# EAGLE design IZU2023_board2_ver7 (2) (EAGLE 9.6.2)
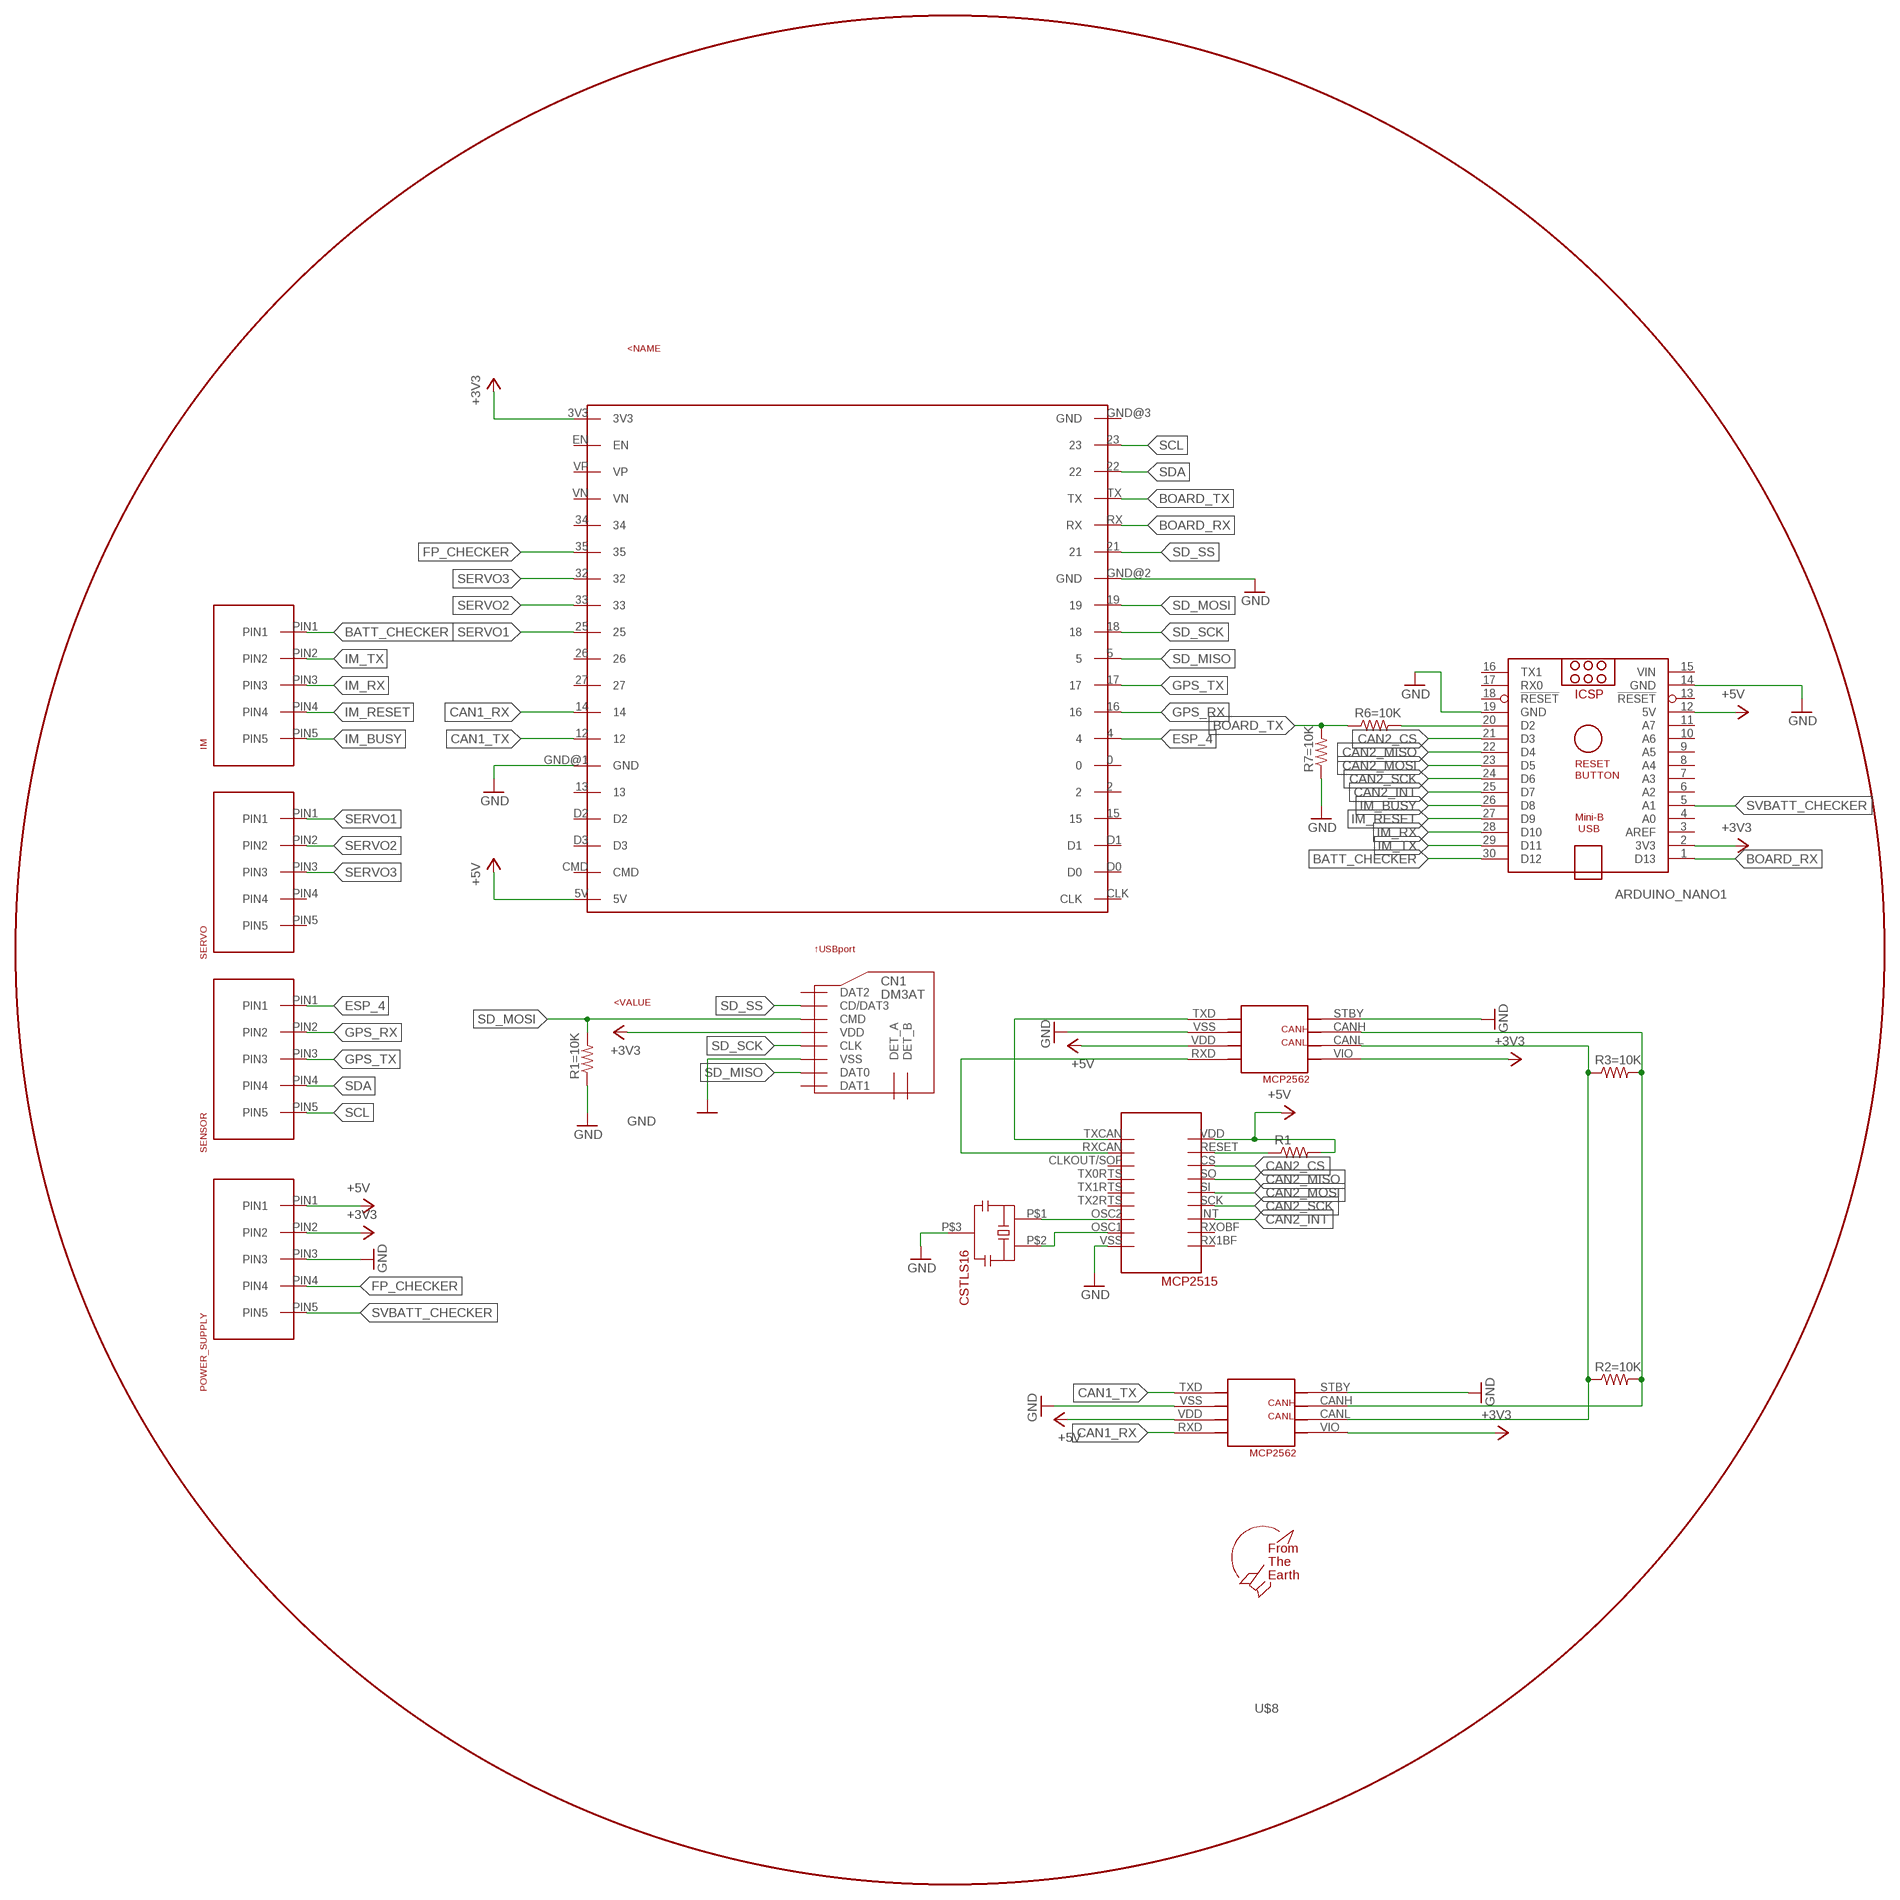
[diagram p0: schematic, sheet 1]

## Parts
ARDUINO_NANO1  ARDUINO_NANO  [ARDUINO_NANO]
CN1  DM3AT  [DM3AT]
IM  5PIN  [5PIN]
POWER_SUPPLY  5PIN  [5PIN]
R1  R-US_0204/7  [0204/7]
R1=10K  R-US_0204/7  [0204/7]
R2=10K  R-US_0204/7  [0204/7]
R3=10K  R-US_0204/7  [0204/7]
R6=10K  R-US_0204/7  [0204/7]
R7=10K  R-US_0204/7  [0204/7]
SENSOR  5PIN  [5PIN]
SERVO  5PIN  [5PIN]
U$1  ESP32-DEVKITC  [ESP32-DEVKITC]
U$2  MCP2515  [MCP2515]
U$3  MCP2562  [MCP2562]
U$4  MCP2562  [MCP2562]
U$5  CSTLS16  [CSTLS16]
U$8  F.T.E.LOGO  [LOGO]

## Nets
+3V3 [Power]: ARDUINO_NANO1.2(3V3) CN1.VDD POWER_SUPPLY.PIN2 U$1.3V3 U$3.VIO U$4.VIO
+5V [Power]: ARDUINO_NANO1.12(5V) POWER_SUPPLY.PIN1 R1.2 U$1.5V U$2.VDD U$3.VDD U$4.VDD
BATT_CHECKER: ARDUINO_NANO1.30(D12) IM.PIN1
BOARD_RX: ARDUINO_NANO1.1(D13) U$1.RX
BOARD_TX: R6=10K.1 R7=10K.2 U$1.TX
CAN1_RX: U$1.14 U$3.RXD
CAN1_TX: U$1.12 U$3.TXD
CAN2_CS: ARDUINO_NANO1.21(D3) U$2.CS
CAN2_INT: ARDUINO_NANO1.25(D7) U$2.INT
CAN2_MISO: ARDUINO_NANO1.22(D4) U$2.SO
CAN2_MOSI: ARDUINO_NANO1.23(D5) U$2.SI
CAN2_SCK: ARDUINO_NANO1.24(D6) U$2.SCK
ESP_4: SENSOR.PIN1 U$1.4
FP_CHECKER: POWER_SUPPLY.PIN4 U$1.35
GND: ARDUINO_NANO1.14(GND) ARDUINO_NANO1.19(GND) CN1.VSS POWER_SUPPLY.PIN3 R1=10K.1 R7=10K.1 U$1.GND@1(GND) U$1.GND@2(GND) U$2.VSS U$3.STBY U$3.VSS U$4.STBY U$4.VSS U$5.P$3
GPS_RX: SENSOR.PIN2 U$1.16
GPS_TX: SENSOR.PIN3 U$1.17
IM_BUSY: ARDUINO_NANO1.26(D8) IM.PIN5
IM_RESET: ARDUINO_NANO1.27(D9) IM.PIN4
IM_RX: ARDUINO_NANO1.28(D10) IM.PIN3
IM_TX: ARDUINO_NANO1.29(D11) IM.PIN2
N$1: U$2.TXCAN U$4.TXD
N$2: ARDUINO_NANO1.20(D2) R6=10K.2
N$3: R2=10K.1 R3=10K.1 U$3.CANL U$4.CANL
N$4: R2=10K.2 R3=10K.2 U$3.CANH U$4.CANH
N$5: U$2.RXCAN U$4.RXD
N$6: U$2.OSC2 U$5.P$1
N$7: U$2.OSC1 U$5.P$2
N$8: R1.1 U$2.RESET
SCL: SENSOR.PIN5 U$1.23
SD_MISO: CN1.DAT0 U$1.5
SD_MOSI: CN1.CMD R1=10K.2 U$1.19
SD_SCK: CN1.CLK U$1.18
SD_SS: CN1.CD/DAT3 U$1.21
SDA: SENSOR.PIN4 U$1.22
SERVO1: SERVO.PIN1 U$1.25
SERVO2: SERVO.PIN2 U$1.33
SERVO3: SERVO.PIN3 U$1.32
SVBATT_CHECKER: ARDUINO_NANO1.5(A1) POWER_SUPPLY.PIN5
Unconnected: ARDUINO_NANO1.3(AREF) ARDUINO_NANO1.4(A0) ARDUINO_NANO1.6(A2) ARDUINO_NANO1.7(A3) ARDUINO_NANO1.8(A4) ARDUINO_NANO1.9(A5) ARDUINO_NANO1.10(A6) ARDUINO_NANO1.11(A7) ARDUINO_NANO1.13(!RESET) ARDUINO_NANO1.16(TX1) ARDUINO_NANO1.17(RX0) ARDUINO_NANO1.18(!RESET) CN1.DAT1 CN1.DAT2 CN1.DET_A CN1.DET_B SERVO.PIN4 SERVO.PIN5 U$1.0 U$1.2 U$1.13 U$1.15 U$1.26 U$1.27 U$1.34 U$1.CLK U$1.CMD U$1.D0 U$1.D1 U$1.D2 U$1.D3 U$1.EN U$1.GND@3(GND) U$1.VN U$1.VP U$2.CLKOUT/SOF U$2.RX1BF U$2.RXOBF(RX0BF) U$2.TX0RTS U$2.TX1RTS U$2.TX2RTS

## Power pins joined to a net without a drawn wire
VIN: ARDUINO_NANO1.15(VIN)

## Library data of the parts
ARDUINO_NANO1 = ArduinoNanoV30:ARDUINO_NANO: Arduino Nano V3.0 Overview: The Arduino Nano is a small, complete, and breadboard-friendly board based on the ATmega328 (Arduino Nano 3.x) or ATmega168 (Arduino Nano 2.x). It has more or less the same functionality of the Arduino Duemilanove, but in a different package. It lacks only a DC power jack, and works with a Mini-B USB cable instead of a standard one. The Nano was designed and is being produced by Gravitech. Specifications: Microcontroller Atmel ATmega168 or ATmega328 Operating Voltage (logic level) 5 V Input Voltage (recommended) 7-12 V Input Voltage (limits) 6-20 V Digital I/O Pins 14 (of which 6 provide PWM output) Analog Input Pins 8 DC Current per I/O Pin 40 mA Flash Memory 16 KB (ATmega168) or 32 KB (ATmega328) of which 2 KB used by bootloader SRAM 1 KB (ATmega168) or 2 KB (ATmega328) EEPROM 512 bytes (ATmega168) or 1 KB (ATmega328) Clock Speed 16 MHz Dimensions 0.73" x 1.70" Length 45 mm Width 18 mm Weigth 5 g Power: The Arduino Nano can be powered via the Mini-B USB connection, 6-20V unregulated external power supply (pin 30), or 5V regulated external power supply (pin 27). The power source is automatically selected to the highest voltage source. Memory: The ATmega168 has 16 KB of flash memory for storing code (of which 2 KB is used for the bootloader); the ATmega328 has 32 KB, (also with 2 KB used for the bootloader). The ATmega168 has 1 KB of SRAM and 512 bytes of EEPROM (which can be read and written with the EEPROM library); the ATmega328 has 2 KB of SRAM and 1 KB of EEPROM. Input and Output: Each of the 14 digital pins on the Nano can be used as an input or output, using pinMode(), digitalWrite(), and digitalRead() functions. They operate at 5 volts. Each pin can provide or receive a maximum of 40 mA and has an internal pull-up resistor (disconnected by default) of 20-50 kOhms. In addition, some pins have specialized functions. Visit Arduino - ArduinoBoardNano <https://www.arduino.cc/en/Main/ArduinoBoardNano>
CN1 = microSD:DM3AT
IM POWER_SUPPLY SENSOR SERVO = connectors:5PIN
R1 R1=10K R2=10K R3=10K R6=10K R7=10K = rcl:R-US_: RESISTOR, American symbol; SPICEPREFIX: R
U$1 = ESP32-DevKitC:ESP32-DEVKITC
U$2 = MCP2515:MCP2515
U$3 U$4 = MCP2562:MCP2562
U$5 = CSTLS16:CSTLS16
U$8 = logo:F.T.E.LOGO

## Net classes
1 Power: width 1.016 mm

## Board
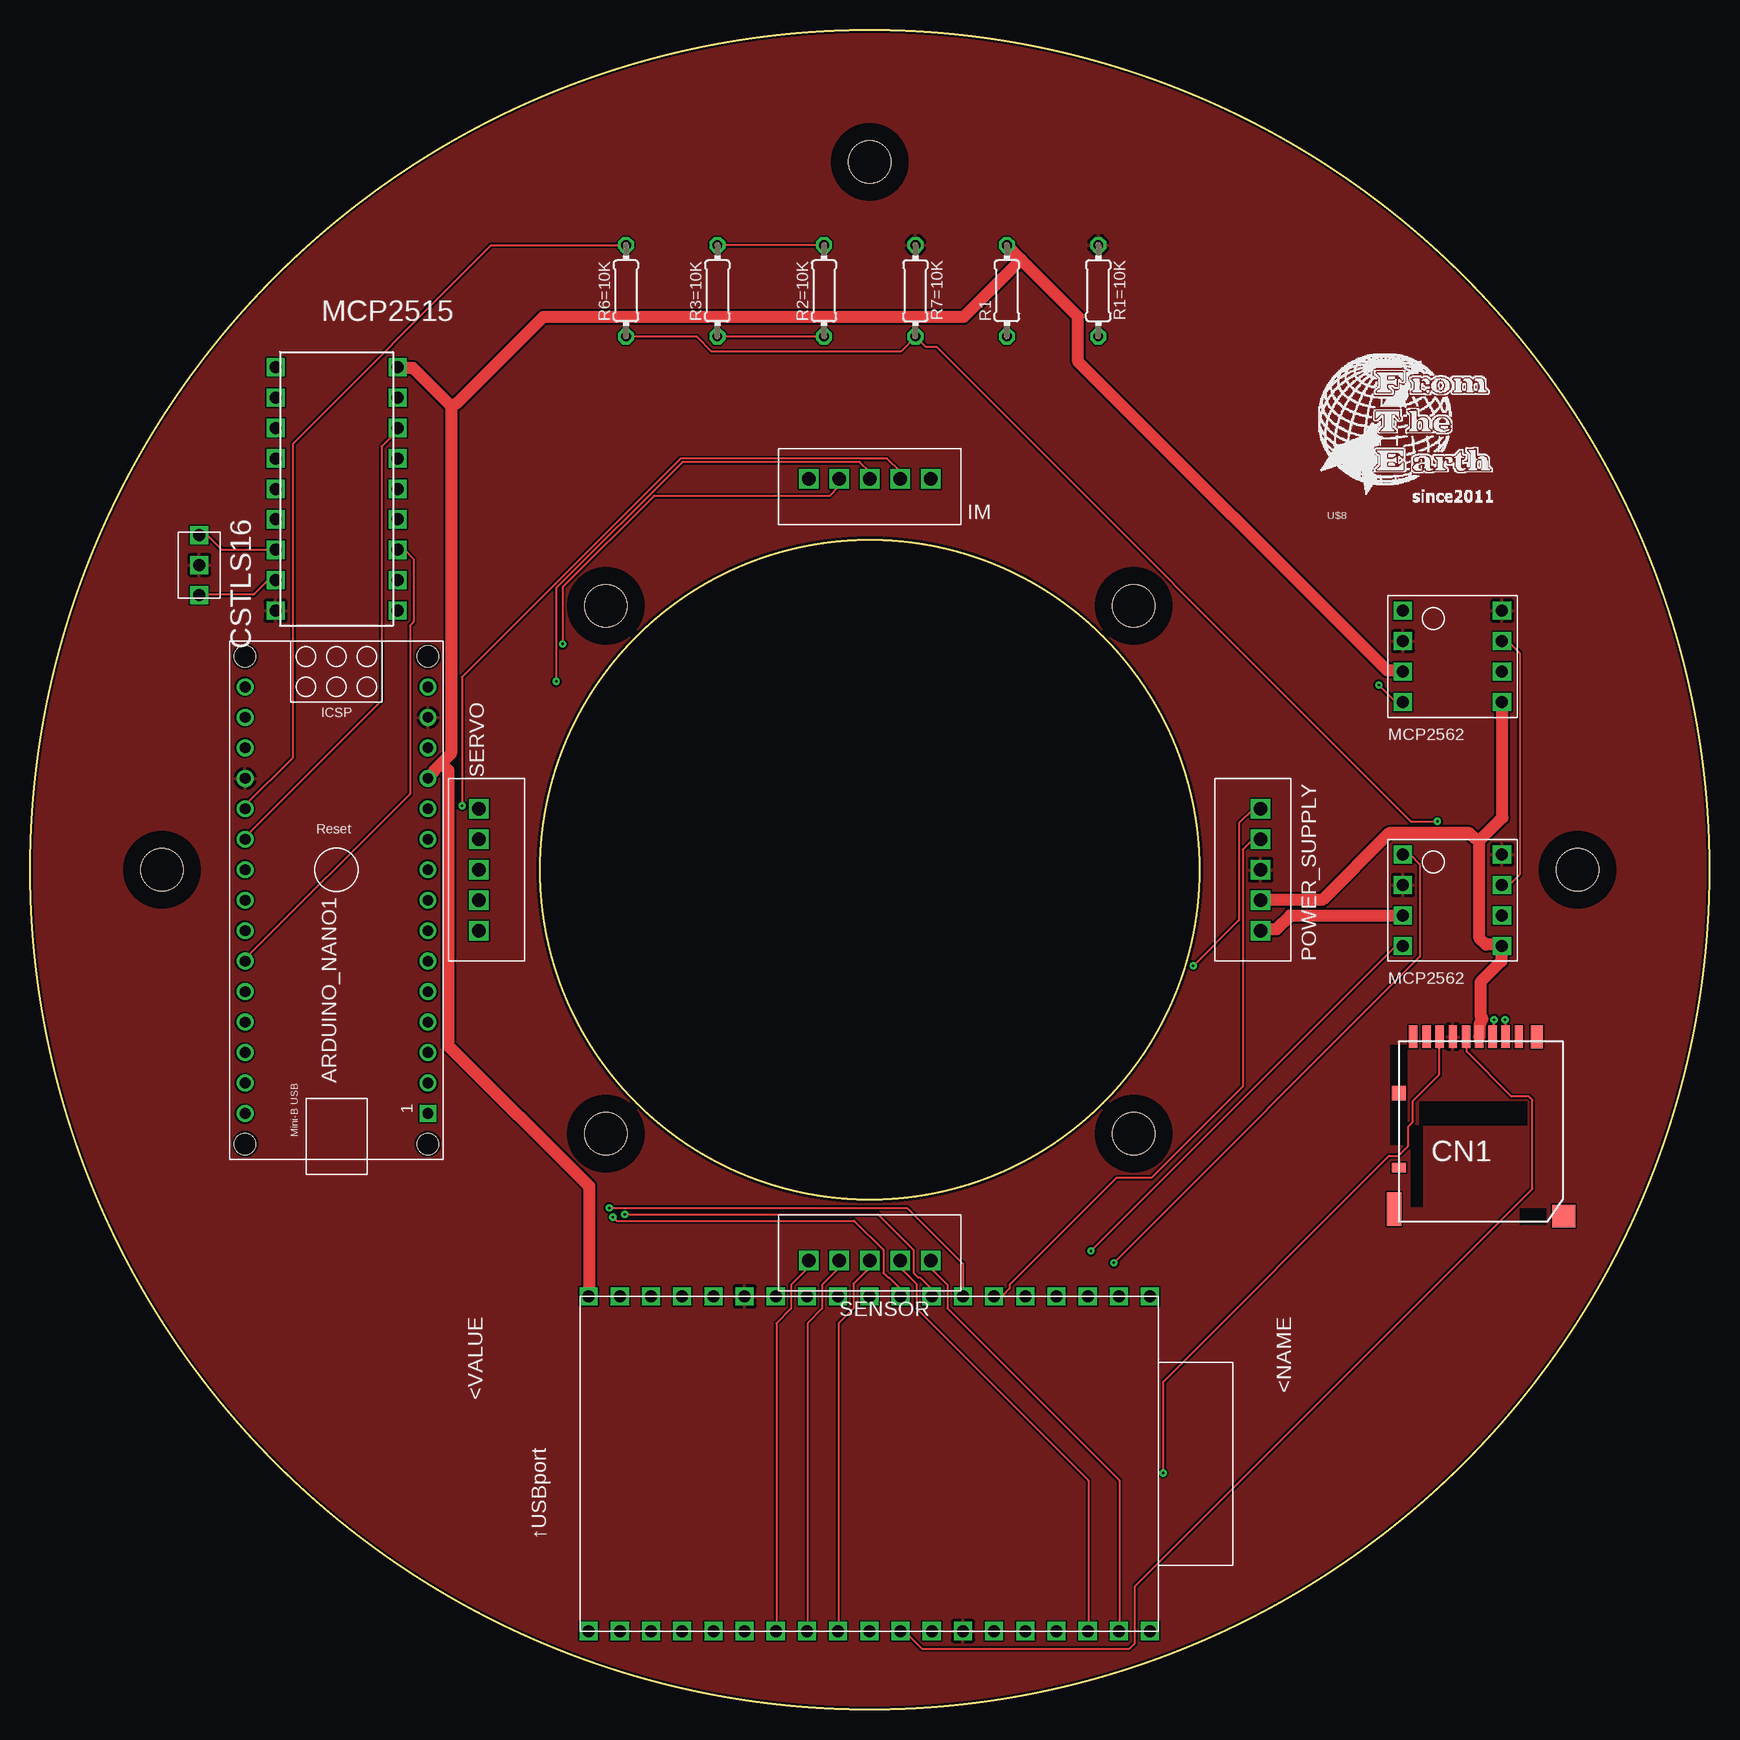
[diagram p1: board, top side]
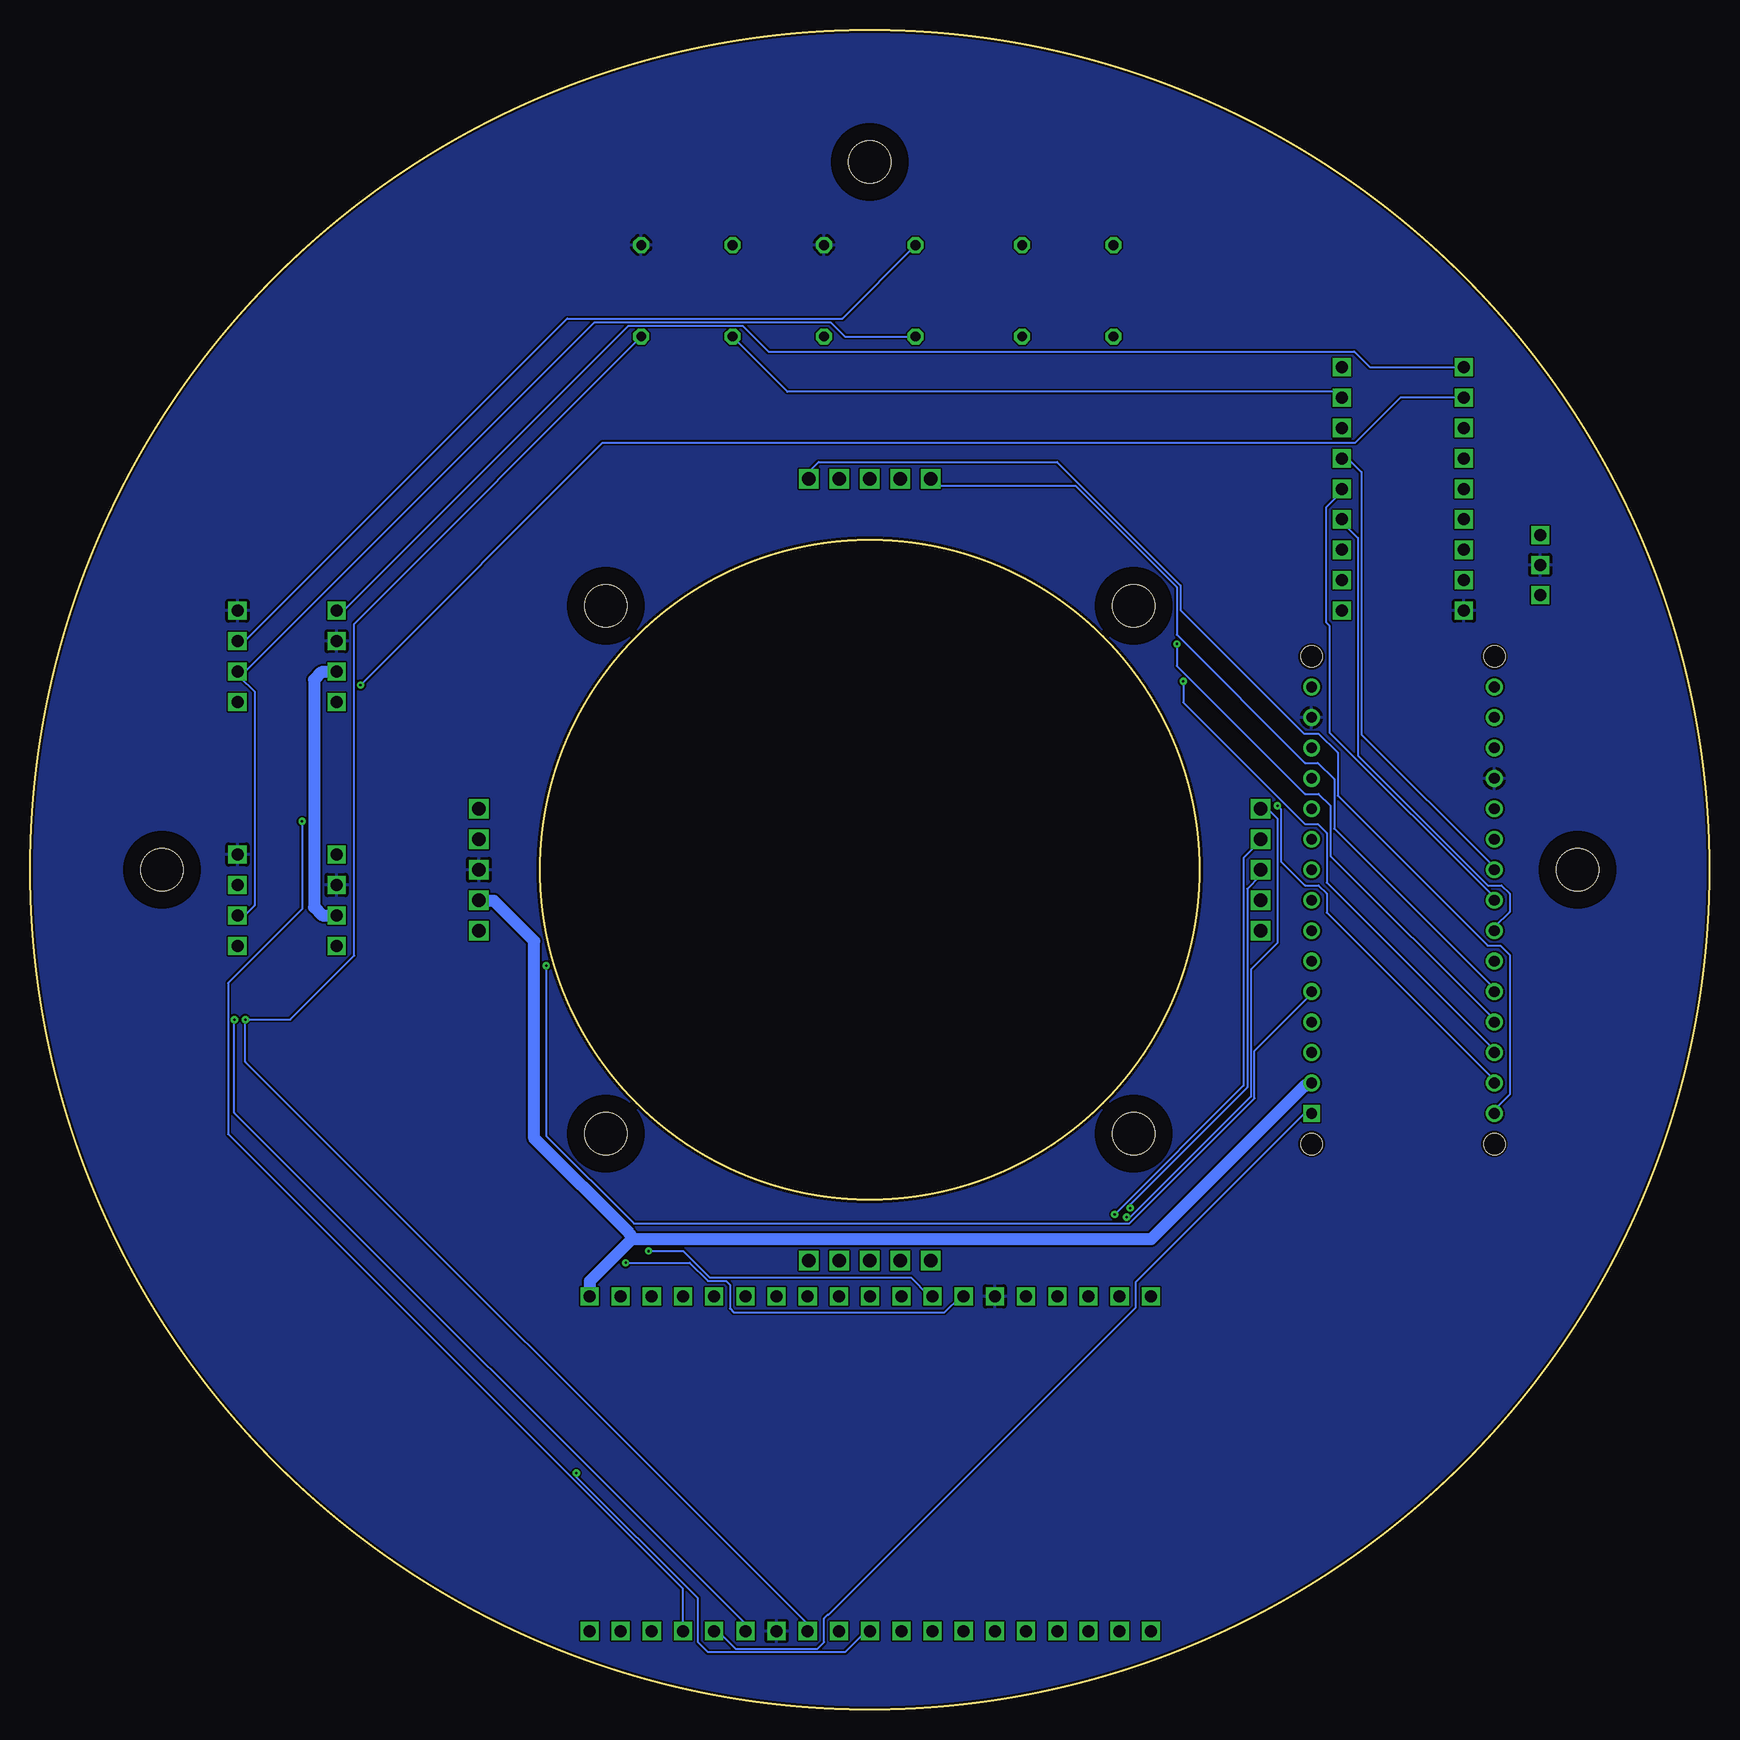
[diagram p2: board, bottom side, seen from below]

Size 140 x 140 mm. Coordinates in mm from the lower left corner, seen from the top.
Outline: circle at 70,70 radius 70
Outline: circle at 70,70 radius 27.5
Copper layers (1*16): Top 0.035mm / dielectric 1.5mm / Bottom 0.035mm
Design rules "PCBGoGo": minimum track width 6mil, minimum drill 0.2mm, track to track 6mil, track to pad 6mil, pad to pad 6mil, via to via 6mil, smd to smd 6mil, copper to edge 0.2mm, drill to drill 6mil, minimum pad ring 10mil, minimum via ring 8mil, stop-mask expansion 4mil, vias tented up to drill 0mil, thermal gap 10mil
Holes 3.5 mm at 70,129 129,70 11,70 92,92 48,48 48,92 92,48
tRestrict: area 44.9,88.8 to 51.1,95.2; area 44.9,44.9 to 51.1,51.1; area 88.8,44.9 to 95.2,51.1; area 88.8,88.8 to 95.2,95.2; area 125.8,66.8 to 132.2,73.2; area 66.8,125.8 to 73.2,132.2; area 7.9,66.8 to 14.1,73.2
bRestrict: area 7.9,66.8 to 14.1,73.2; area 88.8,44.9 to 95.2,51.1; area 125.8,66.8 to 132.2,73.2; area 88.8,88.8 to 95.2,95.2; area 44.9,44.9 to 51.1,51.1; area 44.9,88.8 to 51.1,95.2; area 66.8,125.8 to 73.2,132.2
vRestrict: area 114.5,40.8 to 128.4,56; area 45.9,6.5 to 94.1,34.4; area 16.7,45.9 to 34.4,89; area 11.6,91.6 to 16.7,99.2; area 20.5,90.3 to 30.6,113.2; area 113.2,82.7 to 123.3,92.9; area 113.2,62.4 to 124.6,72.5; area 123.3,82.7 to 124.6,92.9

### Footprints (pad centres in the part's own frame; a part is rotated, then mirrored left to right if it is on the bottom)
ARDUINO_NANO = drill 0.9 square: 1 -20.32,-7.62 | drill 0.9: 2 -17.78,-7.62; 3 -15.24,-7.62; 4 -12.7,-7.62; 5 -10.16,-7.62; 6 -7.62,-7.62; 7 -5.08,-7.62; 8 -2.54,-7.62; 9 0,-7.62; 10 2.54,-7.62; 11 5.08,-7.62; 12 7.62,-7.62; 13 10.16,-7.62; 14 12.7,-7.62; 15 15.24,-7.62; 16 15.24,7.62; 17 12.7,7.62; 18 10.16,7.62; 19 7.62,7.62; 20 5.08,7.62; 21 2.54,7.62; 22 0,7.62; 23 -2.54,7.62; 24 -5.08,7.62; 25 -7.62,7.62; 26 -10.16,7.62; 27 -12.7,7.62; 28 -15.24,7.62; 29 -17.78,7.62; 30 -20.32,7.62 | hole 1.778: -22.86,-7.62; -22.86,7.62; 17.78,7.62; 17.78,-7.62
DM3AT = smd 0.7 x 1.9: CD/DAT3 2.2,6.4; CLK -1.1,6.4; CMD 1.1,6.4; DAT0 -3.3,6.4; DAT1 -4.4,6.4; DAT2 3.3,6.4; DET_B -5.5,6.4; VDD 0,6.4; VSS -2.2,6.4 | smd 1.2 x 0.8: DET_A -6.7,-4.5 | smd 1 x 1.9: P$9 4.8,6.381 | smd 1.2 x 1.2: P$11 -6.7,1.7 | smd 1.2 x 2.8: P$13 -7.081,-7.973 | smd 1.9 x 1.9: P$14 7.054,-8.562
5PIN = drill 1.1 square: PIN1 -5.08,-5.08; PIN2 -2.54,-5.08; PIN3 0,-5.08; PIN4 2.54,-5.08; PIN5 5.08,-5.08
0204/7 = drill 0.813 octagon: 1 -3.81,0; 2 3.81,0
ESP32-DEVKITC = drill 1 square: 0 27.9,13.7; 2 27.9,11.1; 3V3 0,47.5; 4 27.9,16.3; 5 27.9,24.1; 5V 0,0.7; 12 0,16.3; 13 0,11.1; 14 0,18.9; 15 27.9,8.5; 16 27.9,18.9; 17 27.9,21.5; 18 27.9,26.7; 19 27.9,29.3; 21 27.9,34.5; 22 27.9,42.3; 23 27.9,44.9; 25 0,26.7; 26 0,24.1; 27 0,21.5; 32 0,31.9; 33 0,29.3; 34 0,37.1; 35 0,34.5; CLK 27.9,0.7; CMD 0,3.3; D0 27.9,3.3; D1 27.9,5.9; D2 0,8.5; D3 0,5.9; EN 0,44.9; GND@1 0,13.7; GND@2 27.9,31.9; GND@3 27.9,47.5; RX 27.9,37.1; TX 27.9,39.7; VN 0,39.7; VP 0,42.3
MCP2515 = drill 1 square: CLKOUT/SOF -5.08,5.08; CS 5.08,5.08; INT 5.08,-5.08; OSC1 -5.08,-7.62; OSC2 -5.08,-5.08; RESET 5.08,7.62; RX1BF 5.08,-10.16; RXCAN -5.08,7.62; RXOBF 5.08,-7.62; SCK 5.08,-2.54; SI 5.08,0; SO 5.08,2.54; TX0RTS -5.08,2.54; TX1RTS -5.08,0; TX2RTS -5.08,-2.54; TXCAN -5.08,10.16; VDD 5.08,10.16; VSS -5.08,-10.16
MCP2562 = drill 1 square: CANH 8.255,6.35; CANL 8.255,3.81; RXD 0,1.27; STBY 8.255,8.89; TXD 0,8.89; VDD 0,3.81; VIO 8.255,1.27; VSS 0,6.35
CSTLS16 = drill 1 square: P$1 -2.5,0; P$2 2.5,0; P$3 0,0

### Placement (x,y rotation side)
ARDUINO_NANO1  25.55,70 90 top
CN1  120.8,49.68 0 top
IM  70,97.5 180 top
POWER_SUPPLY  97.5,70 90 top
R1  81.43,118.26 90 top
R1=10K  89.05,118.26 270 top
R2=10K  66.19,118.26 90 top
R3=10K  57.3,118.26 90 top
R6=10K  49.68,118.26 90 top
R7=10K  73.81,118.26 270 top
SENSOR  70,42.5 0 top
SERVO  42.5,70 270 top
U$1  45.87,34.44 270 top
U$2  25.55,101.75 0 top
U$3  114.45,62.38 0 top
U$4  114.45,82.7 0 top
U$5  14.12,95.4 270 top
U$8  106.83,99.21 0 top

### Tracks (layer width: path | path; a pad name or v marks a point on that pad's centre or on a via)
+3V3
  Top 1.016: CN1.VDD 120.83,56.13 120.83,57.12 120.9,57.2 120.9,57.35 121.05,57.5 121.05,57.66 120.9,57.81 120.9,60.63 122.65,62.38 122.65,63.6 U$3.VIO 122.2,63.75 121.36,63.75 120.83,64.28 120.83,72.44 | 120.83,72.44 122.73,74.34 122.73,83.94 U$4.VIO | POWER_SUPPLY.PIN2 102.61,67.48 107.72,67.48 113.28,73.05 119.99,73.05 120.37,72.67 120.83,72.44
  Bottom 1.016: 89.81,39.22 46.53,39.22 33.8,51.94 33.73,51.94 33.5,52.17 33.2,52.17 ARDUINO_NANO1.2 | 89.81,39.22 93.32,35.71 93.32,34.49 U$1.3V3 | POWER_SUPPLY.PIN2 102.54,67.41 101.32,67.41 97.97,64.06 97.97,47.6 90.04,39.67 89.81,39.22
+5V
  Top 1.016: U$3.VDD 105.05,66.19 103.91,65.05 102.69,65.05 102.61,64.97 POWER_SUPPLY.PIN1 | 82.61,120.86 87.37,116.1 87.37,112.37 113.13,86.61 114.35,86.61 U$4.VDD | 82.61,120.86 81.43,122.05 R1.2 | 34.3,78.88 35.1,79.68 35.1,108.63 | 34.3,78.88 33.73,78.31 33.73,78.23 33.2,77.7 33.2,77.62 ARDUINO_NANO1.12 | 35.1,108.63 31.9,111.83 30.76,111.83 30.68,111.91 U$2.VDD | U$1.5V 46.61,34.49 46.61,43.64 34.87,55.37 34.87,78.31 34.3,78.88 | 82.61,120.86 77.85,116.1 42.8,116.1 35.56,108.86 35.1,108.63
  Bottom 1.016: U$3.VDD 115.64,66.19 116.33,66.88 116.33,85.85 115.72,86.46 114.5,86.46 U$4.VDD
BATT_CHECKER
  Bottom 0.152: ARDUINO_NANO1.30 17.88,49.73 17.88,50.04 16.66,51.25 16.66,62.91 17.42,63.67 18.49,63.67 30.99,76.17 30.99,79.75 32.59,81.35 33.8,81.35 44.09,91.64 44.09,93.7 54.38,103.98 74.27,103.98 75.03,103.22 75.03,102.61 IM.PIN1
BOARD_RX
  Bottom 0.152: ARDUINO_NANO1.1 33.2,49.66 33.8,49.66 47.83,35.63 47.83,33.5 73.43,7.9 73.5,7.9 73.81,7.59 73.81,5.61 74.34,5.08 81.2,5.08 82.65,6.52 82.95,6.52 U$1.RX
BOARD_TX  (via drill 0.2)
  Top 0.152: 73.81,114.42 72.59,113.2 56.82,113.2 55.6,114.42 49.73,114.42 R6=10K.1 | v117.32,74.04 115.11,74.04 75.56,113.59 74.65,113.59 73.81,114.42 | 73.81,114.42 R7=10K.2
  Bottom 0.152: v117.32,74.04 117.32,66.72 123.49,60.55 123.49,47.98 85.62,10.11 85.62,6.6 U$1.TX
CAN1_RX  (via drill 0.2)
  Top 0.152: v88.44,38.23 113.81,63.6 114.42,63.6 U$3.RXD
  Bottom 0.152: v88.44,38.23 85.55,38.23 83.34,36.02 66.57,36.02 65.05,34.49 64.82,34.49 U$1.14
CAN1_TX  (via drill 0.2)
  Top 0.152: v90.34,37.23 115.87,62.76 115.87,70.46 115.11,71.22 114.5,71.22 U$3.TXD
  Bottom 0.152: v90.34,37.23 85.01,37.23 83.49,35.71 81.96,35.71 81.66,35.41 81.66,33.42 81.35,33.12 63.75,33.12 62.46,34.41 62.23,34.41 U$1.12
CAN2_CS
  Top 0.152: ARDUINO_NANO1.21 17.95,72.59 17.95,72.74 29.31,84.1 29.31,105.28 30.6,106.58 30.6,106.81 U$2.CS
CAN2_INT
  Top 0.152: U$2.INT 31.21,96.67 31.98,95.91 31.98,90.65 31.67,90.34 31.67,76.33 17.95,62.61 17.95,62.38 ARDUINO_NANO1.25
CAN2_MISO
  Bottom 0.152: U$2.SO 30.15,104.29 29,103.15 29,81.28 17.95,70.23 17.95,70 ARDUINO_NANO1.22
CAN2_MOSI
  Bottom 0.152: ARDUINO_NANO1.23 17.95,67.48 17.95,67.71 31.67,81.43 31.67,90.34 31.98,90.65 31.98,100.17 30.68,101.47 30.68,101.7 U$2.SI
CAN2_SCK
  Bottom 0.152: ARDUINO_NANO1.24 17.88,64.97 17.88,65.28 16.66,66.5 16.66,68.02 17.35,68.7 18.49,68.7 29.31,79.53 29.31,97.66 30.6,98.96 30.6,99.19 U$2.SCK
ESP_4
  Top 0.152: U$1.4 62.23,6.6 62.23,32.2 63.45,33.42 63.45,35.41 64.89,36.85 64.89,37.39 SENSOR.PIN1
FP_CHECKER
  Top 0.152: U$1.35 80.44,34.49 81.05,34.49 81.66,35.1 81.66,35.41 90.57,44.32 93.47,44.32 101.09,51.94 101.09,71.68 101.93,72.52 102.54,72.52 POWER_SUPPLY.PIN4
GND
  pour Bottom: 30.63,141.12 103.02,141.12 106.83,137.31 142.39,101.75 142.39,35.71 105.56,-1.12 33.17,-1.12 -4.93,36.98 -4.93,115.72 20.47,141.12
  pour Top: 19.2,144.93 104.29,144.93 147.47,101.75 147.47,31.9 146.2,30.63 110.64,-4.93 109.37,-4.93 26.82,-4.93 -15.09,36.98 -15.09,119.53 -11.28,123.34 10.31,144.93
GPS_RX
  Top 0.152: U$1.16 64.82,6.6 64.82,32.2 66.04,33.42 66.04,35.41 67.41,36.78 67.41,37.39 SENSOR.PIN2
GPS_TX
  Top 0.152: SENSOR.PIN3 70,36.85 68.63,35.48 68.63,33.42 67.41,32.2 67.41,6.6 U$1.17
IM_BUSY
  Bottom 0.152: ARDUINO_NANO1.26 17.95,59.87 17.95,60.09 31.29,73.43 31.29,77.54 32.66,78.91 33.73,78.91 44.4,89.58 44.4,93.55 52.86,102 64.36,102 64.89,102.54 IM.PIN5
IM_RESET  (via drill 0.2)
  Top 0.152: v44.4,88.82 44.4,93.55 52.02,101.17 66.65,101.17 67.41,101.93 67.41,102.54 IM.PIN4
  Bottom 0.152: v44.4,88.82 44.4,86.99 33.73,76.33 32.59,76.33 31.59,75.33 31.59,71.14 17.95,57.5 17.95,57.35 ARDUINO_NANO1.27
IM_RX  (via drill 0.2)
  Top 0.152: v43.86,85.7 43.86,93.47 54.38,103.98 69.16,103.98 70,103.15 IM.PIN3
  Bottom 0.152: v43.86,85.7 43.86,83.94 33.73,73.81 32.66,73.81 31.9,73.05 31.9,68.93 17.95,54.99 17.95,54.76 ARDUINO_NANO1.28
IM_TX  (via drill 0.2)
  Top 0.152: v36.02,75.33 36.02,86.08 54.23,104.29 71.45,104.29 72.52,103.22 72.52,102.61 IM.PIN2
  Bottom 0.152: v36.02,75.33 35.71,75.03 35.71,70.69 33.73,68.7 32.59,68.7 31.9,68.02 31.9,66.42 17.95,52.47 17.95,52.25 ARDUINO_NANO1.29
N$1
  Bottom 0.152: U$2.TXCAN 28.32,111.91 29.61,113.2 78.46,113.2 80.59,115.34 90.12,115.34 113.81,91.64 114.42,91.64 U$4.TXD
N$2
  Top 0.152: R6=10K.2 49.66,122.05 38.45,122.05 21.92,105.51 21.92,79.37 17.95,75.41 17.95,75.11 ARDUINO_NANO1.20
N$3
  Top 0.152: R3=10K.1 57.35,114.42 66.19,114.42 R2=10K.1
  Bottom 0.152: U$3.CANL 122.12,66.19 121.28,67.03 121.28,84.86 122.5,86.08 | 122.5,86.08 122.65,86.23 122.65,86.46 U$4.CANL 122.5,86.08 | 122.5,86.08 92.94,115.64 73.28,115.64 72.06,114.42 66.19,114.42 R2=10K.1
N$4
  Top 0.152: R3=10K.2 57.35,122.05 66.19,122.05 R2=10K.2 | U$4.CANH 123.19,89.05 124.18,88.06 124.18,69.62 123.34,68.78 122.73,68.78 U$3.CANH
  Bottom 0.152: U$4.CANH 122.12,89.05 95.22,115.95 72.29,115.95 66.19,122.05 R2=10K.2
N$5  (via drill 0.2)
  Top 0.152: v112.44,85.39 113.81,84.02 114.42,84.02 U$4.RXD
  Bottom 0.152: v112.44,85.39 92.25,105.59 29.54,105.59 25.73,109.4 20.47,109.4 U$2.RXCAN
N$6
  Top 0.152: U$2.OSC2 15.97,96.67 14.76,97.89 14.15,97.89 U$5.P$1
N$7
  Top 0.152: U$5.P$2 14.15,92.94 18.64,92.94 19.78,94.08 20.47,94.08 U$2.OSC1
N$8
  Bottom 0.152: R1.1 81.43,114.42 76.86,109.85 31.14,109.85 30.68,109.4 U$2.RESET
SCL
  Top 0.152: U$1.23 90.8,6.6 90.8,19.1 76.48,33.42 76.48,35.41 75.11,36.78 75.11,37.39 SENSOR.PIN5
SD_MISO  (via drill 0.2)
  Top 0.152: v94.46,19.71 94.46,27.33 113.28,46.15 114.04,46.15 114.88,46.99 114.88,48.59 115.26,48.97 115.26,50.72 117.47,52.93 117.47,56.05 CN1.DAT0
  Bottom 0.152: v94.46,19.71 94.46,19.4 84.33,9.27 84.33,5.61 83.49,4.77 72.06,4.77 70.31,6.52 70,6.52 U$1.5
SD_MOSI  (via drill 0.2)
  Top 0.152: v122.05,57.5 121.97,57.43 121.97,56.13 CN1.CMD
  Bottom 0.152: U$1.19 75.18,6.6 75.18,7.13 122.05,54 v122.05,57.5 118.31,57.5 112.98,62.84 112.98,90.5 89.05,114.42 R1=10K.2
SD_SCK
  Top 0.152: CN1.CLK 119.76,56.05 119.76,54.84 123.49,51.1 124.94,51.1 125.25,50.8 125.25,43.41 92.1,10.26 92.1,5.53 91.64,5.08 74.34,5.08 72.9,6.52 72.59,6.52 U$1.18
SD_SS  (via drill 0.2)
  Top 0.152: v122.96,57.5 122.96,56.13 CN1.CD/DAT3
  Bottom 0.152: v122.96,57.5 122.96,49.73 80.44,7.21 80.44,6.6 U$1.21
SDA
  Top 0.152: U$1.22 88.21,6.6 88.21,19.1 73.89,33.42 73.89,35.48 72.59,36.78 72.59,37.39 SENSOR.PIN4
SERVO1  (via drill 0.2)
  Top 0.152: v48.59,41.04 48.89,40.74 68.7,40.74 71.14,38.3 71.14,36.4 71.52,36.02 71.6,36.02 72.52,35.1 72.52,34.49 U$1.25
  Bottom 0.152: v48.59,41.04 48.28,41.04 38.23,51.1 38.23,61.69 36.02,63.9 36.02,74.27 36.78,75.03 37.39,75.03 SERVO.PIN1
SERVO2  (via drill 0.2)
  Top 0.152: v49.58,41.27 70.69,41.27 73.66,38.3 73.66,36.4 74.04,36.02 74.19,36.02 75.11,35.1 75.11,34.49 U$1.33
  Bottom 0.152: v49.58,41.27 38.83,52.02 38.83,70.99 37.46,72.36 37.46,72.52 SERVO.PIN2
SERVO3  (via drill 0.2)
  Top 0.152: v48.28,41.81 73.12,41.81 77.77,37.16 77.77,34.49 U$1.32
  Bottom 0.152: v48.28,41.81 48.28,42.11 38.53,51.86 38.53,68.4 37.46,69.47 37.46,70 SERVO.PIN3
SVBATT_CHECKER  (via drill 0.2)
  Top 0.152: v96.97,62 100.78,65.81 100.78,73.89 101.93,75.03 102.54,75.03 POWER_SUPPLY.PIN5
  Bottom 0.152: v96.97,62 96.97,47.83 89.66,40.51 48.36,40.51 37.92,50.95 37.92,54.91 33.2,59.64 33.2,59.79 ARDUINO_NANO1.5